# EAGLE design TachSpeedo (EAGLE 6.5.0)
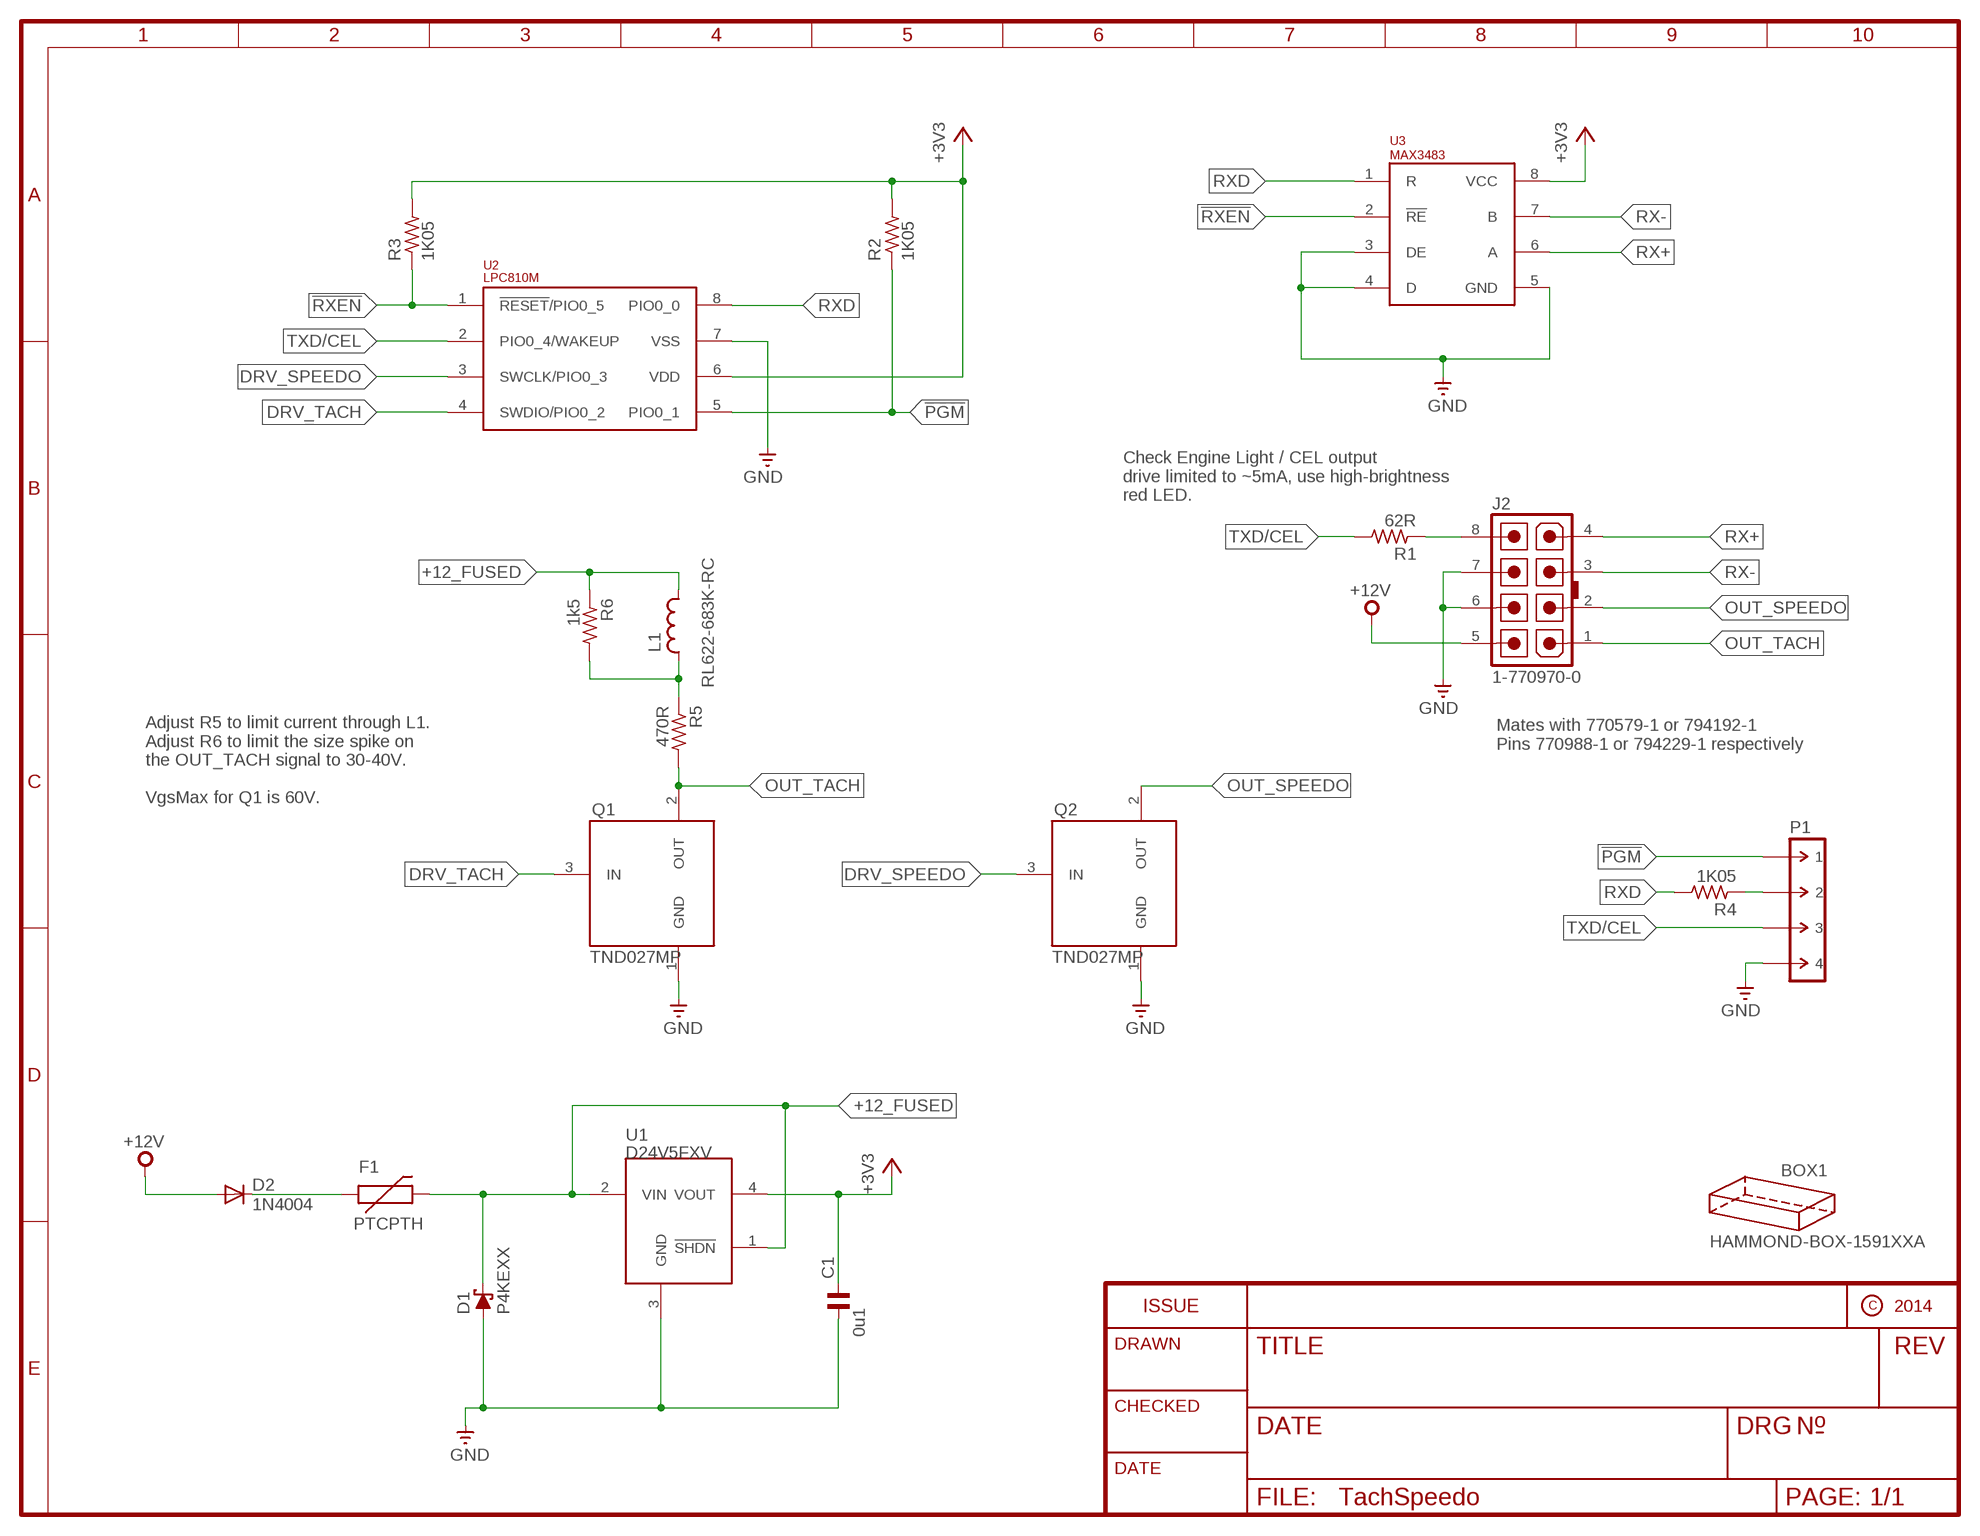
[diagram p0: schematic, sheet 1]

## Parts
BOX1  HAMMOND-BOX-1591XXA  [1591XXA]
C1  0u1  C-EU025-024X044  [C025-024X044]
D1  P4KEXX  [DO41-10]
D2  1N4004  [DO41-10]
F1  PTCPTH  [PTC]
J2  1-770970-0  [1-770970-0]
L1  RL622-683K-RC  RL622  [RL622]
P1  M-1X04-SIP-100-40  [SIP-100-04-40]
Q1  TND027MP  [TO-92]
Q2  TND027MP  [TO-92]
R1  62R  R-EU_0207/10  [0207/10]
R2  1K05  R-EU_0207/10  [0207/10]
R3  1K05  R-EU_0207/10  [0207/10]
R4  1K05  R-EU_0207/10  [0207/10]
R5  470R  R-EU_0207/10  [0207/10]
R6  1k5  R-EU_0207/10  [0207/10]
U1  D24V5FXV  [SIP-100-04-40]
U2  LPC810M  [DIL08]
U3  MAX3483  [DIL08]

## Nets
!PGM: P1.1 R2.1 U2.5(PIO0_1)
!RXEN: R3.1 U2.1(!RESET!/PIO0_5) U3.2(!RE)
+3V3: C1.1 R2.2 R3.2 U1.4(VOUT) U2.6(VDD) U3.8(VCC)
+12_FUSED: D1.C F1.P$2 L1.2 R6.1 U1.1(!SHDN) U1.2(VIN)
+12V: D2.A J2.5
DRV_SPEEDO: Q2.3(IN) U2.3(SWCLK/PIO0_3)
DRV_TACH: Q1.3(IN) U2.4(SWDIO/PIO0_2)
GND: C1.2 D1.A J2.6 J2.7 P1.4 Q1.1(GND) Q2.1(GND) U1.3(GND) U2.7(VSS) U3.3(DE) U3.4(D) U3.5(GND)
N$2: D2.C F1.P$1
N$3: P1.2 R4.1
N$4: J2.8 R1.1
N$6: L1.1 R5.1 R6.2
OUT_SPEEDO: J2.2 Q2.2(OUT)
OUT_TACH: J2.1 Q1.2(OUT) R5.2
RX+: J2.4 U3.6(A)
RX-: J2.3 U3.7(B)
RXD: R4.2 U2.8(PIO0_0) U3.1(R)
TXD/CEL: P1.3 R1.2 U2.2(PIO0_4/WAKEUP)

## Notes on the sheet
- Check Engine Light / CEL output 
  drive limited to ~5mA, use high-brightness
  red LED.
- Mates with 770579-1 or 794192-1 
  Pins 770988-1 or 794229-1 respectively
- Adjust R5 to limit current through L1.
  Adjust R6 to limit the size spike on
  the OUT_TACH signal to 30-40V.
  
  VgsMax for Q1 is 60V.

## Library data of the parts
BOX1 = custom:HAMMOND-BOX: Hammond Project boxes Hammond 1551 Transluscent Blue 50x35x20mm 1551GTBU http://www.hammondmfg.com/pdf/1551G.pdf Hammond 1551 Transluscent Blue 50x50x20mm 1551RTBU http://www.hammondmfg.com/pdf/1551R.pdf Hammond 1551 Transluscent Blue 60x35x20mm 1551HTBU http://www.hammondmfg.com/pdf/1551H.pdf Hammond 1551 Transluscent Blue 80x40x20mm 1551KTBU http://www.hammondmfg.com/pdf/1551K.pdf Hammond 1591 Transluscent Blue 100x51x22m m 1591XXATBU http://www.hammondmfg.com/pdf/1591XXA.pdf; PARTNO: 1591XXAFLBK
C1 = custom:C-EU: CAPACITOR, European symbol; PARTNO: FK18X7R1E104K
D1 = custom:P4KEXX: DIODE transient-voltage suppressor; PARTNO: P4KE30CA
D2 = custom:1N4004: DIODE general purpose rectifier, 1 A; PARTNO: 1N4004
F1 = custom:PTC: Resettable Fuse PTC Resettable Fuse. Spark Fun Electronics SKU : COM-08357; PARTNO: 600R150-RBZR
J2 = custom:1-770970-0: Mini-Universal MATE-N-LOK; PARTNO: 1-770970-0
L1 = custom:RL622: RF CHOKE; PARTNO: RL622-563K-RC
P1 = custom:M-1X04-: MALE HEADER; PARTNO: 961104-6404-AR
Q1 Q2 = custom:TND027MP; PARTNO: TND027MP-AZ
R1 = custom:R-EU_: RESISTOR, European symbol; PARTNO: MFR-25FTE52-62R
R2-R4 = custom:R-EU_: RESISTOR, European symbol; PARTNO: MFR-25FBF52-1K05
R5 = custom:R-EU_: RESISTOR, European symbol; PARTNO: MFR-25FBF52-470R
R6 = custom:R-EU_: RESISTOR, European symbol; PARTNO: MFR-25FRF52-1K5
U1 = custom:D24V5FX; BOM: EXCLUDE
U2 = custom:LPC810M: ARM Cortex-M0 in 8-pin DIP; PARTNO: LPC810M021FN8FP
U3 = custom:MAX3483; PARTNO: MAX3483CPA+

## Board
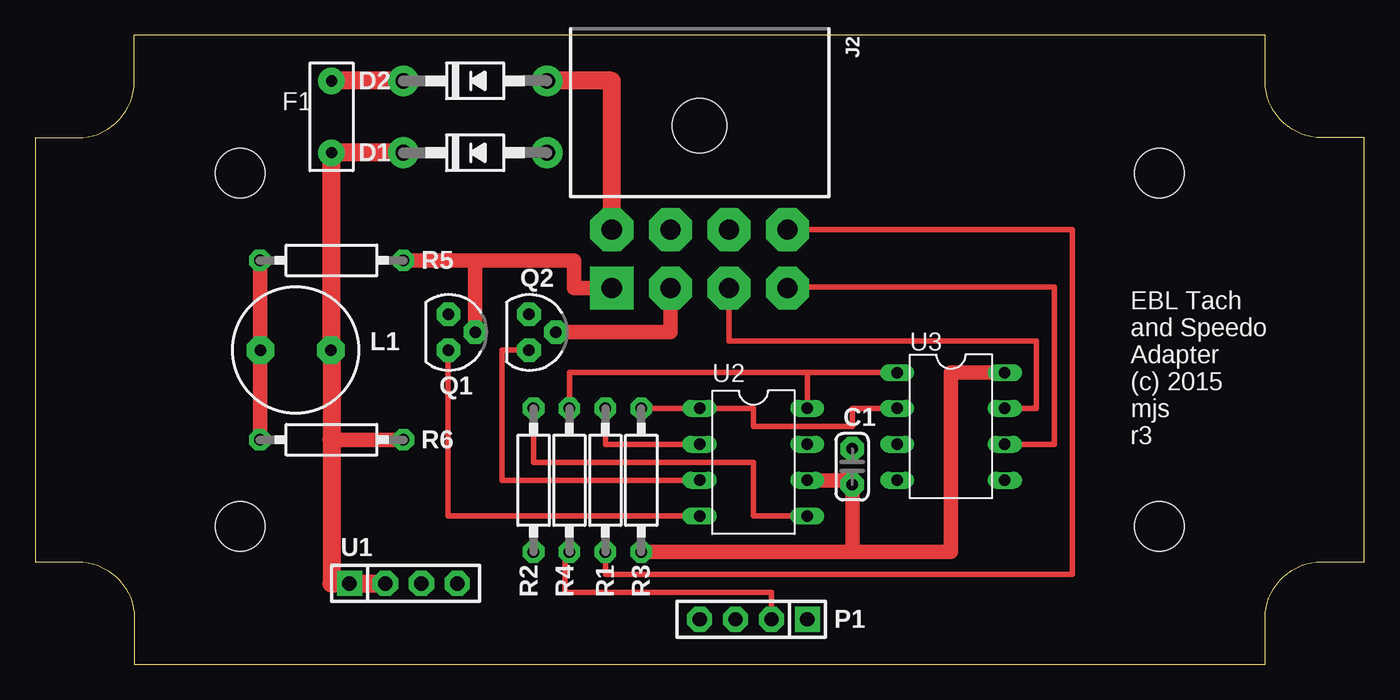
[diagram p1: board, top side]
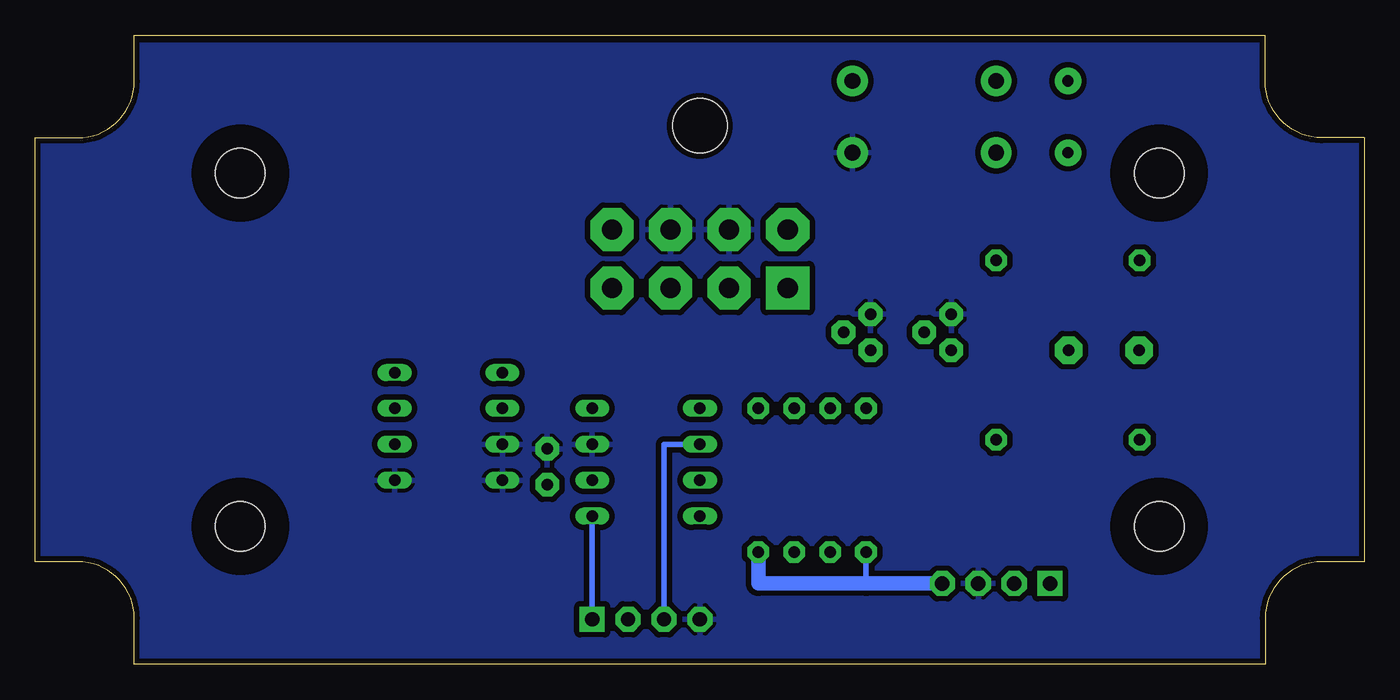
[diagram p2: board, bottom side, seen from below]

Size 94 x 44.5 mm. Coordinates in mm from the lower left corner, seen from the top.
Copper layers (1*16): Top 0.0356mm / dielectric 1.5011mm / Bottom 0.0356mm
Design rules "LaenPCBOrder": minimum track width 6mil, minimum drill 13mil, track to track 6mil, track to pad 6mil, pad to pad 6mil, via to via 6mil, smd to smd 6mil, copper to edge 15mil, drill to drill 6mil, minimum pad ring 7mil, minimum via ring 7mil, stop-mask expansion 3mil, vias tented up to drill 0mil, thermal gap 10mil

### Footprints (pad centres in the part's own frame; a part is rotated, then mirrored left to right if it is on the bottom)
1591XXA = hole 3.5: 79.5,9.75; 14.5,34.75; 79.5,34.75; 14.5,9.75
C025-024X044 = drill 0.813 pad 1.676 octagon: 1 -1.27,0; 2 1.27,0
DO41-10 = drill 1.118 pad 2.184: A 5.08,0; C -5.08,0
PTC = drill 0.8 pad 1.88: P$1 -2.54,0; P$2 2.54,0
1-770970-0 = drill 1.422 pad 3.048 square: 1 6.21,11.48 | drill 1.422 pad 3.048 octagon: 2 2.07,11.48; 3 -2.07,11.48; 4 -6.21,11.48; 5 6.21,7.34; 6 2.07,7.34; 7 -2.07,7.34; 8 -6.21,7.34 | hole 3.86: 0,0
RL622 = drill 0.813 pad 1.93 octagon: 1 -2.5,0; 2 2.5,0
SIP-100-04-40 = drill 1.016 pad 1.778 square: 1 -3.81,0 | drill 1.016 pad 1.778 octagon: 2 -1.27,0; 3 1.27,0; 4 3.81,0
TO-92 = drill 0.813 pad 1.676 octagon: 1 -1.27,0; 2 0,1.905; 3 1.27,0
0207/10 = drill 0.813 pad 1.524 octagon: 1 -5.08,0; 2 5.08,0
DIL08 = drill 0.813 long: 1 -3.81,-3.81; 2 -1.27,-3.81; 3 1.27,-3.81; 4 3.81,-3.81; 5 3.81,3.81; 6 1.27,3.81; 7 -1.27,3.81; 8 -3.81,3.81

### Placement (x,y rotation side)
BOX1  0,0 0 top
C1  57.78,13.97 90 top
D1  31.11,36.2 0 top
D2  31.11,41.27 0 top
F1  20.95,38.73 270 top
J2  46.99,38.1 180 top
L1  18.41,22.23 0 top
P1  50.8,3.17 180 top
Q1  29.21,23.5 270 top
Q2  34.92,23.5 270 top
R1  40.32,13.02 90 top
R2  35.24,13.02 270 top
R3  42.86,13.02 270 top
R4  37.78,13.02 90 top
R5  20.95,28.57 0 top
R6  20.95,15.88 180 top
U1  26.04,5.71 0 top
U2  50.8,14.29 270 top
U3  64.77,16.83 270 top

### Tracks (layer width: path | path; a pad name or v marks a point on that pad's centre or on a via)
!PGM
  Top 0.406: R2.1 35.24,14.29 50.8,14.29 50.8,10.48 U2.5
  Bottom 0.406: P1.1 U2.5
!RXEN
  Top 0.406: R3.1 U2.1 50.8,18.1 50.8,16.83 57.78,16.83 57.78,18.1 U3.2
+3V3
  Top 1.016: U2.6 57.78,13.02 C1.1 57.78,7.94 | R3.2 57.78,7.94 | U3.8 64.77,20.64 64.77,7.94 57.78,7.94
  Bottom 0.406: R2.2 35.24,5.71
  Bottom 1.016: U1.4 35.24,5.71 42.86,5.71 R3.2
+12_FUSED
  Top 1.016: R6.1 20.95,15.88
  Top 1.27: D1.C F1.P$2 20.91,36.2 L1.2 20.95,22.23 20.95,15.88 20.95,5.71 U1.1 U1.2
+12V
  Top 1.27: J2.5 40.78,41.27 D2.A
DRV_SPEEDO
  Top 0.406: U2.3 33.02,13.02 33.02,22.23 Q2.3
DRV_TACH
  Top 0.406: U2.4 29.21,10.48 Q1.3
GND
  pour Bottom (isolate 0.381): 0.32,0.32 93.66,0.32 93.66,43.81 0.32,43.81
N$2
  Top 1.27: D2.C F1.P$1
N$3
  Top 0.406: R4.1 37.47,7.94 37.47,5.08 52.07,5.08 P1.2
N$4
  Top 0.406: R1.1 40.32,6.35 73.34,6.35 73.34,30.76 J2.8
N$6
  Top 1.016: R6.2 15.91,15.88 L1.1 15.91,28.57 R5.1
OUT_SPEEDO
  Top 1.016: Q2.2 44.92,23.5 J2.2
OUT_TACH
  Top 1.016: R5.2 31.11,28.57 | 31.11,28.57 Q1.2 | J2.1 38.1,26.62 38.1,28.57 31.11,28.57
RX+
  Top 0.406: U3.6 72.07,15.56 72.07,26.67 53.2,26.67 J2.4
RX-
  Top 0.406: U3.7 70.8,18.1 70.8,22.86 49.06,22.86 J2.3
RXD
  Top 0.406: R4.2 37.78,20.64 54.61,20.64 | 54.61,20.64 U2.8 | U3.1 54.61,20.64
TXD/CEL
  Top 0.406: R1.2 40.32,15.56 U2.2
  Bottom 0.406: U2.2 49.53,15.56 P1.3

### Text on the board
tNames: EBL Tach / and Speedo / Adapter / (c) 2015 / mjs / r3